# EasyEDA Pro project ReuseBlock_电子工程实训-物联网终端-朱玉施，黄彬_2025-01-02.epro

# Schematic 电子工程实训-物联网终端-朱玉施，黄彬
Board Name: 最小物联网赋能板; Create Date: 2024-11-22; Page Name: P1; Project Name: 24秋专业设计-律动灯条; Schematic Name: Schematic1; Update Date: 2024-12-26; Company: 嘉立创EDA; Page Size: A3; Version: V1.0
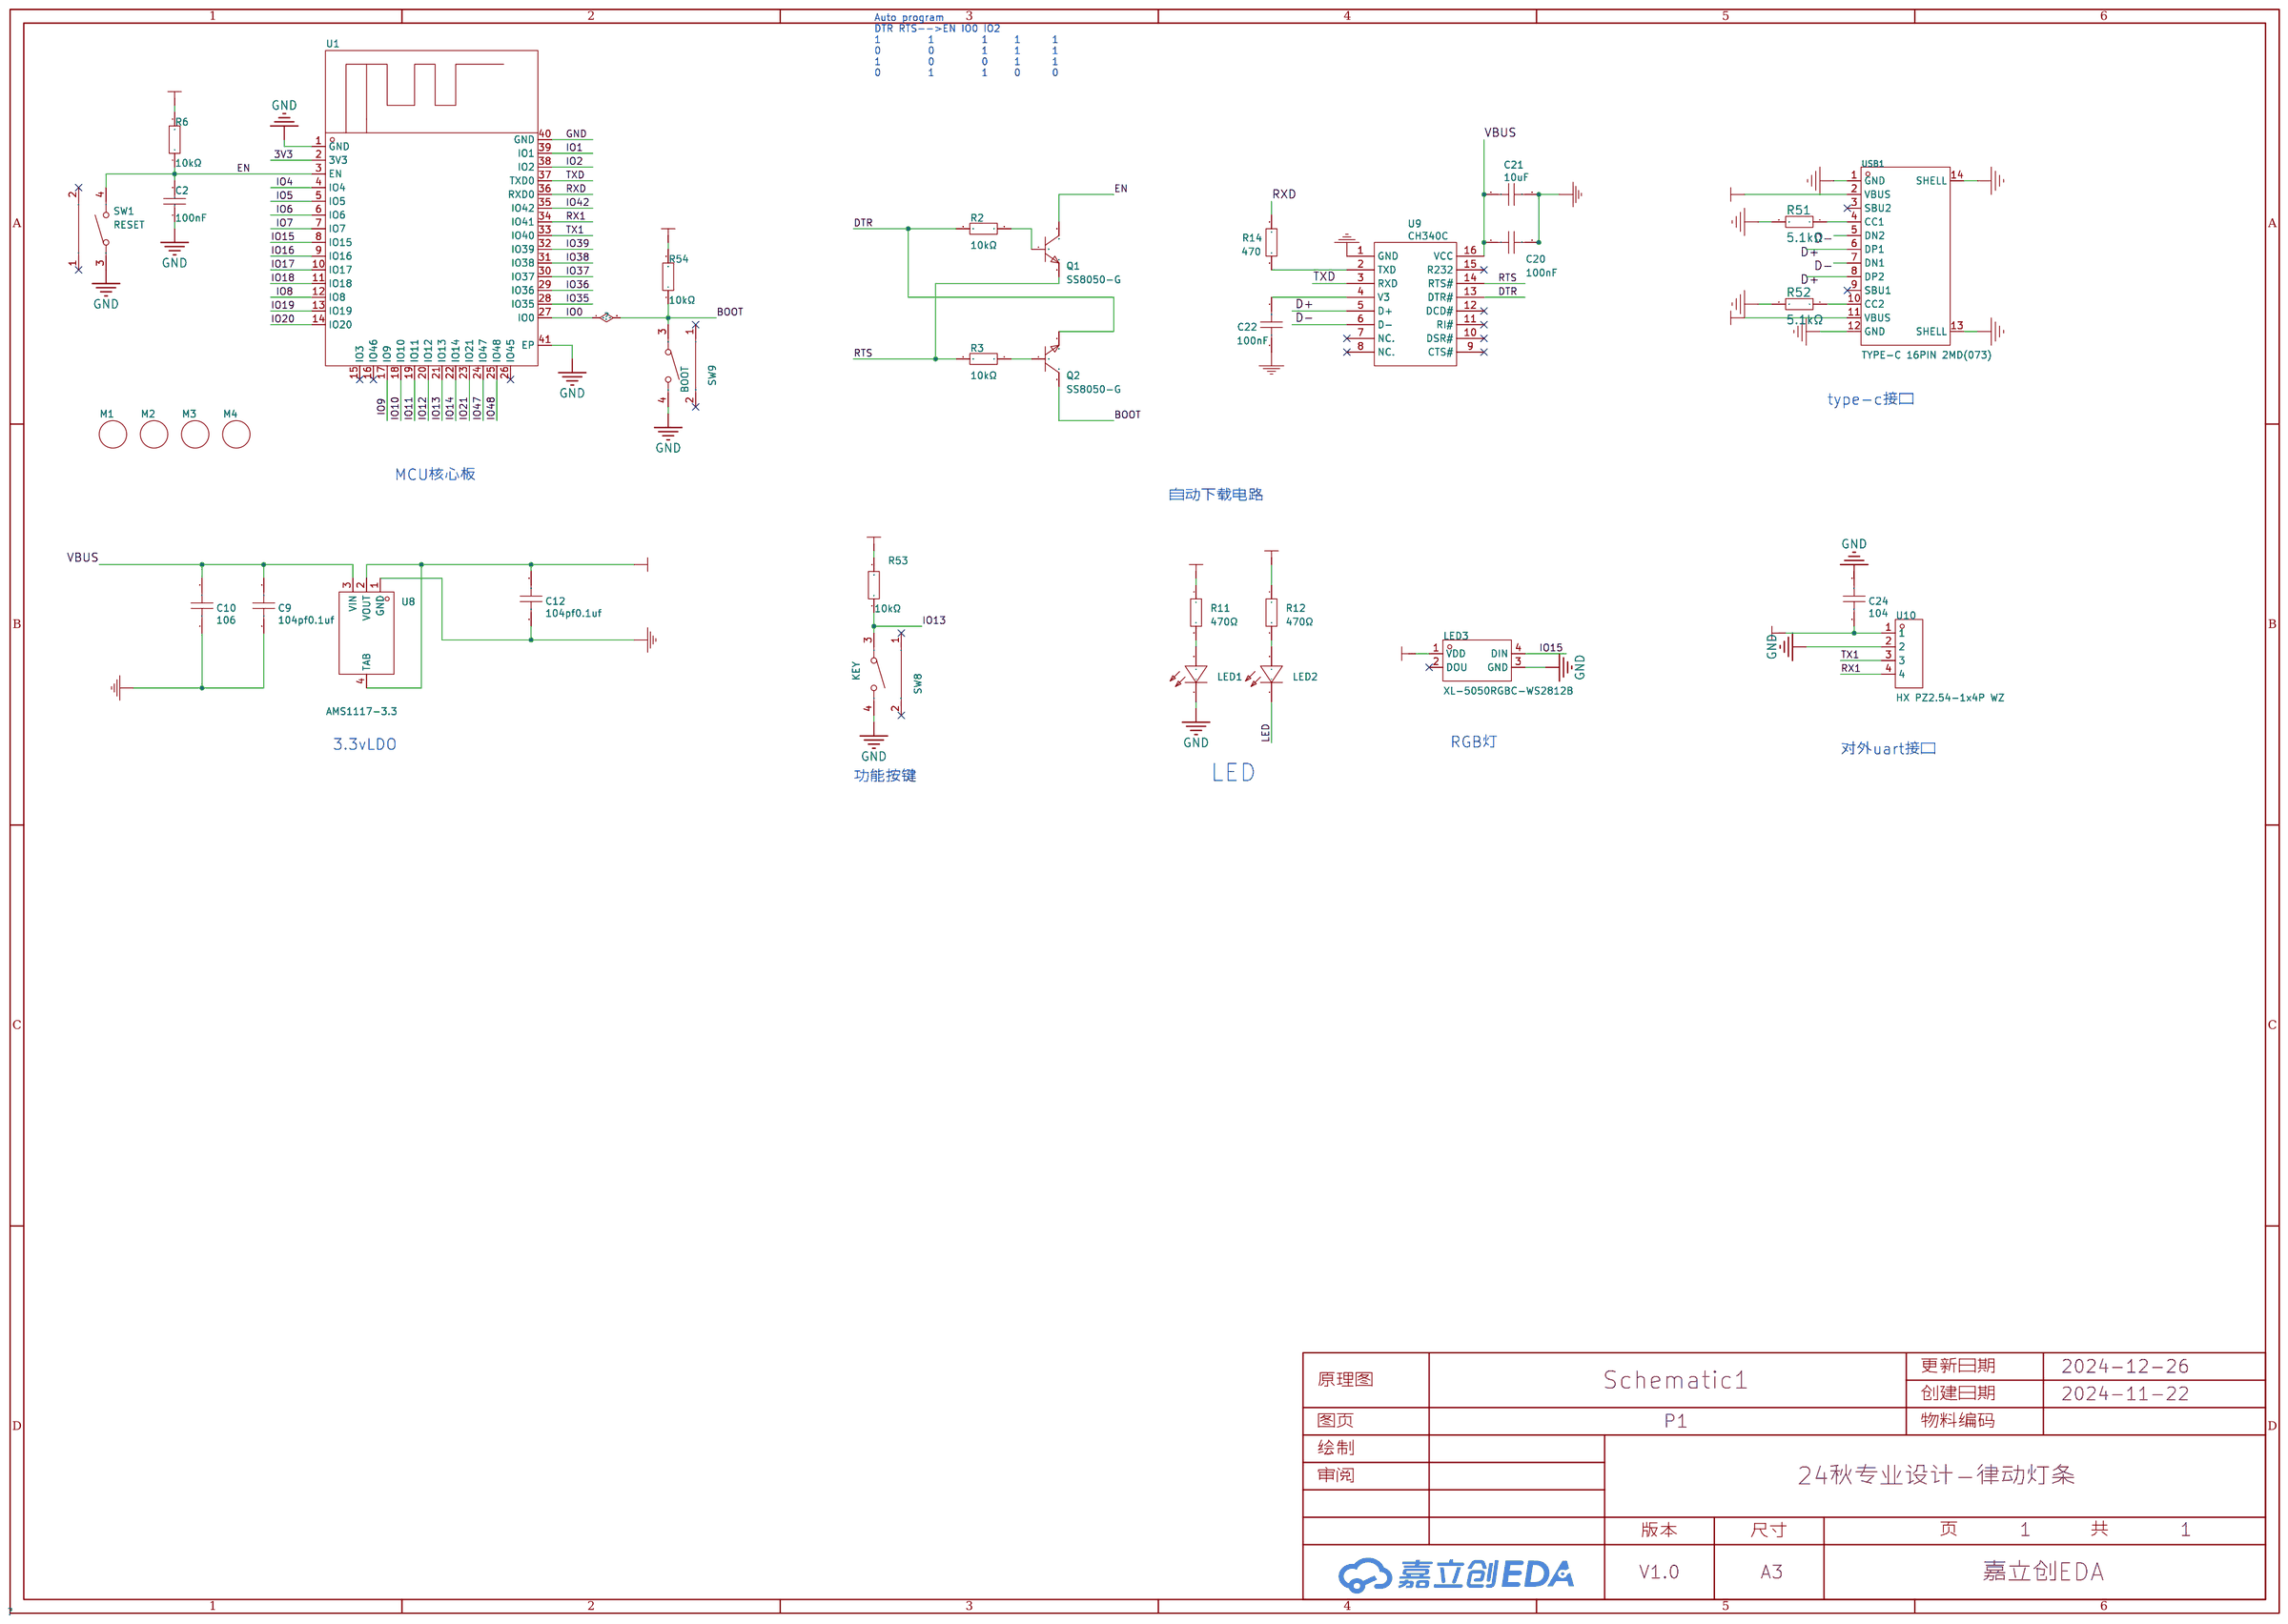
[diagram p0: schematic sheet]

## Parts
C2  100nF  [C0603]
C9  104pf0.1uf  [C0603]
C10  106  [C0603]
C12  104pf0.1uf  [C0603]
C20  100nF  [C0603]
C21  10uF  [C0603]
C22  100nF  [C0603]
C24  104  [C0603]
LED1  TJ-S2012CY8T5ALC2G-A5  [LED0805-RD_GREEN]
LED2  TJ-S2012CY8T5ALC2G-A5  [LED0805-RD_GREEN]
LED3  XL-5050RGBC-WS2812B  [LED-SMD_4P-L5.0-W5.0-BL_XL-5050RGBC]
M1  -  [M3螺丝孔]
M2  -  [M3螺丝孔]
M3  -  [M3螺丝孔]
M4  -  [M3螺丝孔]
Q1  SS8050-G  [SOT-23-3_L2.9-W1.6-P1.90-LS2.8-BR]
Q2  SS8050-G  [SOT-23-3_L2.9-W1.6-P1.90-LS2.8-BR]
R2  10kΩ  [R0603]
R3  10kΩ  [R0603]
R6  10kΩ  [R0603]
R11  470Ω  [R0603]
R12  470Ω  [R0603]
R14  470  [R0603]
R51  5.1kΩ  [R0603]
R52  5.1kΩ  [R0603]
R53  10kΩ  [R0603]
R54  10kΩ  [R0603]
SW1  RESET  [SW-SMD_TS24CA]
SW8  KEY  [SW-SMD_TS24CA]
SW9  BOOT  [SW-SMD_TS24CA]
U1  ESP32-S3-WROOM-1-N8  [WIFIM-SMD_ESP32-S3-WROOM-1-N8]
U8  AMS1117-3.3  [SOT-223-3_L6.5-W3.5-P3.05-LS7.0]
U9  CH340C  [SOP-16_L10.0-W3.9-P1.27-LS6.0-BL]
U10  HX PZ2.54-1x4P WZ  [HDR-TH_4P-P2.54-H-M-W10.3]
USB1  TYPE-C 16PIN 2MD(073)  [USB-C-SMD_TYPE-C-6PIN-2MD-073]

## Library data of the parts
C2 = CL10A105KB8NNNC: 容值:1uF;精度:±10%;额定电压:50V;材质(温度系数):X5R;; LCSC Part Name: 1uF ±10% 50V; Supplier Part: C15849; Manufacturer: SAMSUNG(三星); Supplier Footprint: 0603; JLCPCB Part Class: 基础库; Datasheet: https://atta.szlcsc.com/upload/public/pdf/source/20160103/1457707679084.pdf; Supplier: LCSC; Tolerance: ±10%; Voltage Rated: 50V; Temperature Coefficient: X5R
C9 C10 C12 C24 = 0603B393K101CT: Supplier: LCSC; Supplier Part: C458880; Manufacturer: Walsin Tech Corp
C20 C22 = CC0603KRX7R9BB104: Supplier: LCSC; Manufacturer: YAGEO; Supplier Part: C14663; JLCPCB Part Class: Basic Part
C21 = CL10A106KP8NNNC: Supplier: LCSC; Manufacturer: SAMSUNG; Supplier Part: C19702; JLCPCB Part Class: Basic Part
LED1 LED2 = TJ-S2012CY8T5ALC2G-A5: 发光颜色:翠绿;; LCSC Part Name: 翠绿; Supplier Part: C440522; Manufacturer: TOGIALED(统佳); Supplier Footprint: 0805; JLCPCB Part Class: 扩展库; Datasheet: https://atta.szlcsc.com/upload/public/pdf/source/20191029/C440522_4363B29F18325C993551AE0B09333676.pdf; Supplier: LCSC; Emitted Color: 翠绿
LED3 = XL-5050RGBC-WS2812B: 5050七彩幻彩透明贴片LED灯珠 5050 幻彩透明四脚 ws2812B 内置驱动IC; Supplier Part: C2843785; Manufacturer: XINGLIGHT(成兴光); Supplier Footprint: SMD5050; JLCPCB Part Class: 扩展库; Datasheet: https://atta.szlcsc.com/upload/public/pdf/source/20240412/E1004CAA80592E31D08BFE019083806F.pdf; Supplier: LCSC
M1-M4 = M3螺丝孔
Q1 Q2 = SS8050-G_C164886: VBUS; LCSC Part Name: VBUS; Supplier Part: C164886; Manufacturer: CJ(江苏长电/长晶); Supplier Footprint: SOT-23; JLCPCB Part Class: 扩展库; Datasheet: https://atta.szlcsc.com/upload/public/pdf/source/20171228/C164886_15144412883891213890.pdf; Supplier: LCSC; Transistor Type: NPN; Collector-Emitter Breakdown Voltage (Vceo): VBUS; Collector Current (Ic): 1.5A; Power Dissipation (Pd): 300mW; Collector Cut-Off Current (Icbo): 100nA; Collector-Emitter Saturation Voltage (VCE(sat)@Ic,Ib): 500mV@800mA,80mA; DC Current Gain (hFE@Ic,Vce): 120@100mA,1V; Transition Frequency (fT): 100MHz; Operating Temperature: +150℃@(Tj)
R2 R3 = 0805W8F1002T5E_C17414: 电阻类型:厚膜电阻;阻值:10kΩ;精度:±1%;功率:125mW;; LCSC Part Name: 10kΩ ±1% 125mW; Supplier Part: C17414; Manufacturer: UNI-ROYAL(厚声); Manufacturer Part: 0805W8F1002T5E; Supplier Footprint: 0805; JLCPCB Part Class: 基础库; Datasheet: https://atta.szlcsc.com/upload/public/pdf/source/20200306/C422600_1E6D84923E4A46A82E41ADD87F860B5C.pdf; Supplier: LCSC; Type: 厚膜电阻; Tolerance: ±1%; Power(Watts): 125mW; Temperature Coefficient: ±100ppm/℃; Overload Voltage (Max): 150V; Operating Temperature Range: -55℃~+155℃
R6 R53 R54 = RC0603FR-0710KL: 电阻类型:厚膜电阻;阻值:10kΩ;精度:±1%;功率:100mW;温度系数:±100ppm/℃;最大工作电压:75V;工作温度范围:-55℃~+155℃;; LCSC Part Name: 10kΩ ±1% 100mW; Supplier Part: C98220; Manufacturer: YAGEO(国巨); Supplier Footprint: 0603; JLCPCB Part Class: 扩展库; Datasheet: https://atta.szlcsc.com/upload/public/pdf/source/20170522/1495423494387.pdf; Supplier: LCSC; Type: 厚膜电阻; Tolerance: ±1%; Power(Watts): 100mW; Temperature Coefficient: ±100ppm/℃; Overload Voltage (Max): 75V; Operating Temperature Range: -55℃~+155℃
R11 R12 = 0603WAF5100T5E: 电阻类型:厚膜电阻;阻值:510Ω;精度:±1%;功率:100mW;温度系数:±100ppm/℃;最大工作电压:75V;工作温度范围:-55℃~+155℃;; LCSC Part Name: 510Ω ±1% 100mW; Supplier Part: C23193; Manufacturer: UNI-ROYAL(厚声); Supplier Footprint: 0603; JLCPCB Part Class: 基础库; Datasheet: https://atta.szlcsc.com/upload/public/pdf/source/20200306/C422600_1E6D84923E4A46A82E41ADD87F860B5C.pdf; Supplier: LCSC; Type: 厚膜电阻; Tolerance: ±1%; Power(Watts): 100mW; Temperature Coefficient: ±100ppm/℃; Overload Voltage (Max): 75V; Operating Temperature Range: -55℃~+155℃
R14 = 0603WAF4700T5E: Supplier: LCSC; Manufacturer: UniOhm; Supplier Part: C23179; JLCPCB Part Class: Basic Part
R51 R52 = 0603WAF5101T5E: 电阻类型:厚膜电阻;阻值:5.1kΩ;精度:±1%;功率:100mW;温度系数:±100ppm/℃;; LCSC Part Name: 厚膜电阻 5.1kΩ ±1% 100mW; Supplier Part: C23186; Manufacturer: UNI-ROYAL(厚声); Supplier Footprint: 0603; JLCPCB Part Class: Basic Part; Datasheet: https://atta.szlcsc.com/upload/public/pdf/source/20200306/C422600_1E6D84923E4A46A82E41ADD87F860B5C.pdf; Supplier: LCSC; Type: 厚膜电阻; Tolerance: ±1%; Power(Watts): 100mW; Temperature Coefficient: ±100ppm/℃; Overload Voltage (Max): VBUS; Operating Temperature Range: -55℃~+155℃; Origin Footprint 1: R 0603_M; Design Item ID: R; Library Name: 0.1 - 电阻-电容-电感; BOM名称: 贴片电阻; 联系售后: https://shop463601444.taobao.com; 版权归属: 来自淘宝 ID：黄晶宝石; 封装库来自淘宝卖家 ID：黄晶宝石: 其他店铺购入均为盗版，不享受售后技术支持服务，请立即申请退款; Origin Footprint 2: R 0201_L; Origin Footprint 3: R 0402_L; Origin Footprint 4: R 0603_L; Origin Footprint 5: R 0805_L; Origin Footprint 6: R 1206_L; Origin Footprint 7: R 1210_L; Origin Footprint 8: R 1812_L; Origin Footprint 9: R 2010_L; Origin Footprint 10: R 2512_L; Origin Footprint 11: R 0201_M; Origin Footprint 12: R 0402_M; Origin Footprint 13: R 0805_M; Origin Footprint 14: R 1206_M; Origin Footprint 15: R 1210_M; Origin Footprint 16: R 1812_M; Origin Footprint 17: R 2010_M; Origin Footprint 18: R 2512_M
SW1 SW8 SW9 = TS24CA: 触点电流:50mA;额定电压(DC):12V;电路结构:单刀单掷;安装方式:卧贴;按钮形状:矩形按钮;带灯:-;开关长度:4.55mm;开关宽度:1.8mm;开关高度:3.5mm;; LCSC Part Name: 2*4*3.5半包小贝贝TS-018小侧按键m165蓝牙耳机轻触开关; Supplier Part: C393942; Manufacturer: SHOU HAN(首韩); Supplier Footprint: SMD; JLCPCB Part Class: 扩展库; Datasheet: https://atta.szlcsc.com/upload/public/pdf/source/20190521/C393942_591A9E318887EFA4274D34029981AD99.pdf; Supplier: LCSC; Contact Current: 50mA; Voltage Rating (DC): 12V; Circuit: 单刀单掷; Mounting Style: 卧贴; Actuator Style: 矩形按钮; Switch Length: 4.55mm; Switch Width: 1.8mm; Switch Height: 3.5mm
U1 = ESP32-S3-WROOM-1-N8: Supplier Part: C2913198; Manufacturer: ESPRESSIF(乐鑫); Supplier Footprint: 模块; JLCPCB Part Class: Extended Part; Datasheet: https://atta.szlcsc.com/upload/public/pdf/source/20221026/9A44C6421221D672346AAE72DF9F8146.pdf; Supplier: LCSC
U8 = AMS1117-3.3_C5250992: 输出类型：固定 输出极性：正 最大输入电压：18V 输出电压：3.3V 输出电流：1A 电源纹波抑制比(PSRR)：60dB@(120Hz)。当前应用较多领域：三端稳压器，机顶盒; Supplier Part: C5250992; Manufacturer: TWGMC(台湾迪嘉); Supplier Footprint: SOT-223-3L; JLCPCB Part Class: 扩展库; Datasheet: https://atta.szlcsc.com/upload/public/pdf/source/20221109/A58A92B07670E85D28928AE371260E8D.pdf; Supplier: LCSC
U9 = CH340C: Supplier: LCSC; Manufacturer: WCH; Supplier Part: C84681; JLCPCB Part Class: Extended Part
U10 = HX PZ2.54-1x4P WZ: 插针结构:1x4P;间距:2.54mm;行距:-;圆针/方针:方针;安装类型:弯插;排数:单排;总PIN位数:4P;额定电流:3A;额定电压:-;配合针长度:6mm;塑高:2.5mm;端接针长度:3mm;触头材质:黄铜;触头镀层:金;工作温度范围:-40℃~+105℃;颜色:黑色;; LCSC Part Name: 1x4P 间距:2.54mm 方针 弯插; Supplier Part: C32713263; Manufacturer: hanxia(韩下); Supplier Footprint: 弯插,P=2.54mm; JLCPCB Part Class: 扩展库; Datasheet: https://atta.szlcsc.com/upload/public/pdf/source/20240723/CEFBB84DDE30BB0D161FEC6DC376B233.pdf; Supplier: LCSC; Pin Structure: 1x4P; Pitch: 2.54mm; Circluar Pins/Square Pins: 方针; Mounting Type: 弯插; Number of Rows: 单排; Number of Pins: 4P; Current Rating (Max): 3A; Length of Mating Pin: 6mm; Insulation Height: 2.5mm; Length of End Connection Pin: 3mm; Contact Material: 黄铜; Contact Plating: 金; Operating Temperature Range: -40℃~+105℃; Color: 黑色
USB1 = TYPE-C 16PIN 2MD(073): 连接器类型:Type-C;标准:-;公母:母座;触点数量:16;端口数量:1;安装方式:卧贴;额定电流 - 电源:5A;工作温度范围:-25℃~+85℃;; LCSC Part Name: TYPE-C母座 16P 4脚插件带定位柱 不锈钢外壳 2次模顶; Supplier Part: C2765186; Manufacturer: SHOU HAN(首韩); Supplier Footprint: SMD; JLCPCB Part Class: Extended Part; Supplier: LCSC; Connector Type: Type-C; Gender: 母座; Number of Contacts: 16; Number of Ports: 1; Mounting Style: 卧贴; Current Rating - Power (Max): 5A; Operating Temperature Range: -25℃~+85℃

## Nets
3V3: C12.2 C24.1 LED3.1(VDD) R6.2 R11.1 R12.1 R53.2 R54.2 U1.2(3V3) U8.2(VOUT) U8.4(TAB) U10.1
GND: C2.1 C9.1 C10.1 C12.1 C20.2 C21.2 C22.1 C24.2 LED1.1(-) LED3.3(GND) R51.2 R52.2 SW1.3 SW8.4 SW9.4 U1.1(GND) U1.40(GND) U1.41(EP) U8.1(GND) U9.1(GND) U10.2 USB1.1(GND) USB1.12(GND) USB1.13(SHELL) USB1.14(SHELL)
VBUS: C9.2 C10.2 C20.1 C21.1 U8.3(VIN) U9.16(VCC) USB1.2(VBUS) USB1.11(VBUS)
BOOT: Q2.3(C) R54.1 SW9.3 U1.27(IO0)
D+: U9.5(D+) USB1.6(DP1) USB1.8(DP2)
D-: U9.6(D-) USB1.5(DN2) USB1.7(DN1)
DTR: Q2.2(E) R2.2 U9.13(DTR#)
EN: C2.2 Q1.3(C) R6.1 SW1.4 U1.3(EN)
IO1: U1.39(IO1)
IO2: U1.38(IO2)
IO4: U1.4(IO4)
IO5: U1.5(IO5)
IO6: U1.6(IO6)
IO7: U1.7(IO7)
IO8: U1.12(IO8)
IO9: U1.17(IO9)
IO10: U1.18(IO10)
IO11: U1.19(IO11)
IO12: U1.20(IO12)
IO13: R53.1 SW8.3 U1.21(IO13)
IO14: U1.22(IO14)
IO15: LED3.4(DIN) U1.8(IO15)
IO16: U1.9(IO16)
IO17: U1.10(IO17)
IO18: U1.11(IO18)
IO19: U1.13(IO19)
IO20: U1.14(IO20)
IO21: U1.23(IO21)
IO35: U1.28(IO35)
IO36: U1.29(IO36)
IO37: U1.30(IO37)
IO38: U1.31(IO38)
IO39: U1.32(IO39)
IO42: U1.35(IO42)
IO47: U1.24(IO47)
IO48: U1.25(IO48)
LED: LED2.1(-)
RTS: Q1.2(E) R3.2 U9.14(RTS#)
RX1: U1.34(IO41) U10.4
RXD: R14.1 U1.36(RXD0)
TX1: U1.33(IO40) U10.3
TXD: U1.37(TXD0) U9.3(RXD)
$1N1434: Q1.1(B) R2.1
$1N1435: Q2.1(B) R3.1
$1N1444: R14.2 U9.2(TXD)
$1N1449: C22.2 U9.4(V3)
$1N2488: R51.1 USB1.4(CC1)
$1N2489: R52.1 USB1.10(CC2)
Net-(LED1-2): LED1.2(+) R11.2
Net-(LED2-2): LED2.2(+) R12.2

Not connected (* = marked no-connect by the designer): LED3 2(DOU)*; SW1 1* 2*; SW8 1* 2*; SW9 1* 2*; U1 15(IO3)* 16(IO46)* 26(IO45)*; U9 7(NC.)* 8(NC.)* 9(CTS#)* 10(DSR#)* 11(RI#)* 12(DCD#)* 15(R232)*; USB1 3(SBU2)* 9(SBU1)*

## Notes on the sheet
- Auto program
  DTR RTS-->EN IO0 IO2
  1         1         1     1      1
  0         0         1     1      1
  1         0         0     1      1
  0         1         1     0      0
- type-c接口
- MCU核心板
- 自动下载电路
- 3.3vLDO
- RGB灯
- 对外uart接口
- 功能按键
- LED

# Board 电子工程实训-物联网终端-朱玉施，黄彬
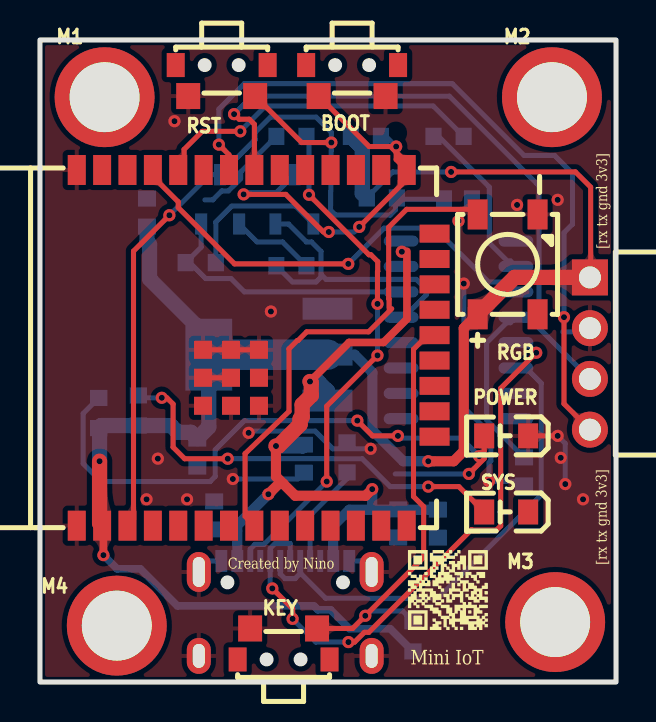
[diagram p1: board, top side]
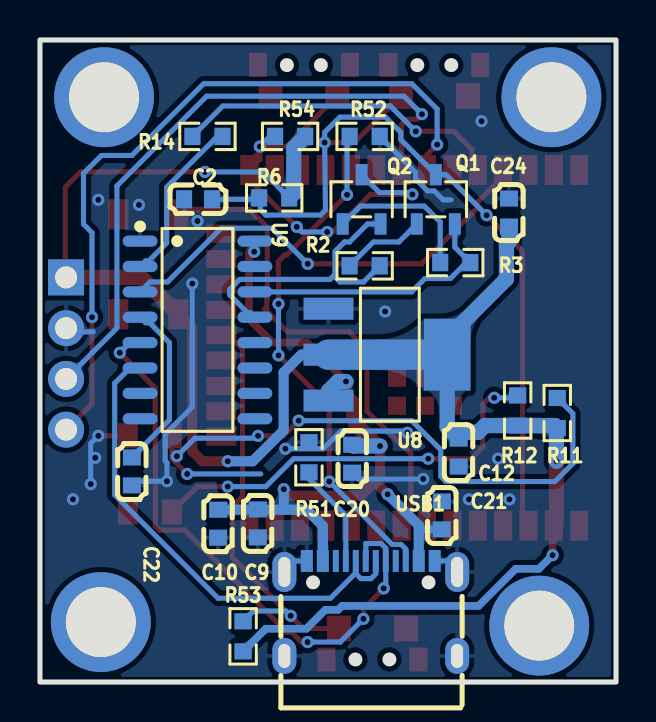
[diagram p2: board, bottom side, seen from below]

Outline 28.83 x 32.13 mm; copper layers: Top Layer, Bottom Layer. Coordinates in mm from the lower left corner of the outline.
Outline path: rectangle 0,32.13 28.83,0
Stack: Top Layer 0.035mm / Dielectric1 1.51mm FR4 er 4.5 / Bottom Layer 0.035mm

## Design rules (mm)
template: JLCPCB Capability(Two Layers Board)
spacing copperThickness1oz (default): track to track 0.102, other pairs 0.152 to 0.3
spacing copperThickness2oz: track to track 0.203, other pairs 0.152 to 0.3
track width copperThickness1oz (default): min 0.127, default 0.254, max 2.54
track width copperThickness2oz: min 0.203, default 0.254, max 2.54
differential pair differentialPair (default): width min 0.127, default 0.254, max 2.54; gap min 0.152, default 0.152
via viaSize (default): diameter min 0.5, default 0.61, max 10; hole min 0.3, default 0.305, max 6.3

## Placement (name value [footprint] x y rotation side)
BOOT  BOOT  [SW-SMD_TS24CA]  15.62 30.1 0 top
C2  100nF  [C0603]  20.92 24.16 180 bottom
C9  104pf0.1uf  [C0603]  17.93 7.94 90 bottom
C10  106  [C0603]  19.91 7.92 90 bottom
C12  104pf0.1uf  [C0603]  7.87 11.48 90 bottom
C20  100nF  [C0603]  13.21 11.18 270 bottom
C21  10uF  [C0603]  8.72 8.34 90 bottom
C22  100nF  [C0603]  24.23 10.54 90 bottom
C24  104  [C0603]  5.35 23.5 90 bottom
KEY  KEY  [SW-SMD_TS24CA]  12.19 1.91 180 top
M1  -  [M3螺丝孔]  3.23 29.27 0 top
M2  -  [M3螺丝孔]  25.62 29.27 0 top
M3  -  [M3螺丝孔]  25.78 3 0 top
M4  -  [M3螺丝孔]  3.84 2.82 0 top
POWER  TJ-S2012CY8T5ALC2G-A5  [LED0805-RD_GREEN]  23.33 12.32 180 top
Q1  SS8050-G  [SOT-23-3_L2.9-W1.6-P1.90-LS2.8-BR]  9.02 24.16 270 bottom
Q2  SS8050-G  [SOT-23-3_L2.9-W1.6-P1.90-LS2.8-BR]  12.73 24.16 270 bottom
R2  10kΩ  [R0603]  12.58 20.83 180 bottom
R3  10kΩ  [R0603]  8.05 20.99 180 bottom
R6  10kΩ  [R0603]  17.11 24.23 180 bottom
R11  470Ω  [R0603]  2.94 13.46 90 bottom
R12  470Ω  [R0603]  4.92 13.59 90 bottom
R14  470  [R0603]  20.45 27.31 180 bottom
R51  5.1kΩ  [R0603]  15.37 11.25 90 bottom
R52  5.1kΩ  [R0603]  12.58 27.31 180 bottom
R53  10kΩ  [R0603]  18.66 2.29 270 bottom
R54  10kΩ  [R0603]  16.31 27.31 180 bottom
RGB  XL-5050RGBC-WS2812B  [LED-SMD_4P-L5.0-W5.0-BL_XL-5050RGBC]  23.4 20.9 0 top
RST  RESET  [SW-SMD_TS24CA]  9.09 30.1 0 top
SYS  TJ-S2012CY8T5ALC2G-A5  [LED0805-RD_GREEN]  23.33 8.51 180 top
U1  ESP32-S3-WROOM-1-N8  [WIFIM-SMD_ESP32-S3-WROOM-1-N8]  10.79 16.72 90 top
U8  AMS1117-3.3  [SOT-223-3_L6.5-W3.5-P3.05-LS7.0]  11.42 16.38 0 bottom
U9  CH340C  [SOP-16_L10.0-W3.9-P1.27-LS6.0-BL]  20.95 17.62 270 bottom
U10  HX PZ2.54-1x4P WZ  [HDR-TH_4P-P2.54-H-M-W10.3]  27.52 16.44 270 top
USB1  TYPE-C 16PIN 2MD(073)  [USB-C-SMD_TYPE-C-6PIN-2MD-073]  12.27 3.68 180 bottom

## Footprints (pads in the part's own frame, mm; a bottom-side part is the same pattern mirrored in y, then rotated)
C0603
  rect 0.8x0.9 smd: 1(-0.7,0) 2(0.7,0)
HDR-TH_4P-P2.54-H-M-W10.3
  rect 1.8x1.8 hole 1.1: 1(-3.81,0)
  round 1.8 hole 1.1: 2(-1.27,0) 3(1.27,0) 4(3.81,0)
LED0805-RD_GREEN
  rect 1.001x1.25 smd: 1(-1.1,0) 2(1.1,0)
LED-SMD_4P-L5.0-W5.0-BL_XL-5050RGBC
  rect 1x1.5 smd: 1(-1.5,-2.5) 2(1.5,-2.5) 3(1.5,2.5) 4(-1.5,2.5)
M3螺丝孔
  round 5 hole 3.5: 1(0,0)
R0603
  rect 0.806x0.864 smd: 1(-0.753,0) 2(0.753,0)
SOP-16_L10.0-W3.9-P1.27-LS6.0-BL
  oval 0.56x1.745 smd: 1(-4.445,-2.873) 2(-3.175,-2.873) 3(-1.905,-2.873) 4(-0.635,-2.873) 5(0.635,-2.873) 6(1.905,-2.873) 7(3.175,-2.873) 8(4.445,-2.873) 9(4.445,2.873) 10(3.175,2.873) 11(1.905,2.873) 12(0.635,2.873) 13(-0.635,2.873) 14(-1.905,2.873) 15(-3.175,2.873) 16(-4.445,2.873)
SOT-23-3_L2.9-W1.6-P1.90-LS2.8-BR
  rect 1.07x0.6 smd: 1(1.235,-0.95) 2(1.235,0.95) 3(-1.235,0)
SOT-223-3_L6.5-W3.5-P3.05-LS7.0
  rect 2.5x1.1 smd: 1(2.97,-2.3) 2(2.97,0) 3(2.97,2.3)
  rect 2.34x3.6 smd: 4(-2.97,0)
SW-SMD_TS24CA
  rect 0.9x1.2 smd: 1(-2.3,0.775) 2(2.3,0.775)
  rect 1.2x1.3 smd: 3(-1.675,-0.775) 4(1.675,-0.775)
USB-C-SMD_TYPE-C-6PIN-2MD-073
  rect 0.6x1.1 smd: 1(-3.2,2.375) 2(-2.4,2.375) 11(2.4,2.375) 12(3.2,2.375)
  rect 0.3x1.1 smd: 3(-1.75,2.375) 4(-1.25,2.375) 5(-0.75,2.375) 6(-0.25,2.375) 7(0.25,2.375) 8(0.75,2.375) 9(1.25,2.375) 10(1.75,2.375)
  oval 1.2x1.8 hole 0.6x1.2: 13(-4.325,-2.375) 14(4.325,-2.375)
  oval 1.2x2 hole 0.6x1.5: 13(-4.325,1.825) 14(4.325,1.825)
WIFIM-SMD_ESP32-S3-WROOM-1-N8
  rect 1.5x0.9 smd: 1(-8.9,8.954) 2(-8.9,7.684) 3(-8.9,6.415) 4(-8.9,5.144) 5(-8.9,3.874) 6(-8.9,2.604) 7(-8.9,1.335) 8(-8.9,0.065) 9(-8.9,-1.206) 10(-8.9,-2.475) 11(-8.9,-3.745) 12(-8.9,-5.016) 13(-8.9,-6.285) 14(-8.9,-7.556) 27(8.9,-7.556) 28(8.9,-6.285) 29(8.9,-5.016) 30(8.9,-3.745) 31(8.9,-2.475) 32(8.9,-1.206) 33(8.9,0.065) 34(8.9,1.335) 35(8.9,2.604) 36(8.9,3.874) 37(8.9,5.144) 38(8.9,6.415) 39(8.9,7.684) 40(8.9,8.954)
  rect 0.9x1.5 smd: 17(-4.445,-8.954) 18(-3.175,-8.954) 19(-1.905,-8.954) 20(-0.635,-8.954) 21(0.635,-8.954) 22(1.905,-8.954) 23(3.175,-8.954) 24(4.445,-8.954) 25(5.715,-8.954)
  rect 0.9x0.9 smd: 41(-2.9,2.635) 41(-2.9,1.235) 41(-2.9,-0.165) 41(-1.5,2.635) 41(-1.5,1.235) 41(-1.5,-0.165) 41(-0.1,2.635) 41(-0.1,1.235) 41(-0.1,-0.165)

## Nets
As in the schematic, except:
3V3: C12.2 C24.1 R6.2 R11.1 R12.1 R53.2 R54.2 RGB.1 U1.2 U8.2 U8.4 U10.1
GND: BOOT.4 C2.1 C9.1 C10.1 C12.1 C20.2 C21.2 C22.1 C24.2 KEY.4 POWER.1 R51.2 R52.2 RGB.3 RST.3 U1.1 U1.40 U1.41 U8.1 U9.1 U10.2 USB1.1 USB1.12 USB1.13 USB1.14
BOOT: BOOT.3 Q2.3 R54.1 U1.27
EN: C2.2 Q1.3 R6.1 RST.4 U1.3
IO13: KEY.3 R53.1 U1.21
IO15: RGB.4 U1.8
$1N2023: POWER.2 R11.2
$1N2024: R12.2 SYS.2

Pads without a net: BOOT 1 2; KEY 1 2; M1 1; M2 1; M3 1; M4 1; RGB 2; RST 1 2; U9 7 8 9 10 11 12 15; USB1 3 9

## Via types
v1: diameter 0.61, hole 0.305, Top Layer to Bottom Layer, 53 vias

## Routing (per net, layer and track width the routed paths; a pad name or vN(x,y) marks a point on that pad's centre or on a via; arc(x,y) is an arc through that point)
3V3: length 91.6
  Top Layer w0.254: U10.1 27.56,20.29 27.56,24.77 26.8,25.53 v1(20.57,25.53)
  Top Layer w0.381: v1(3.18,6.35) 3.18,7.76
  Top Layer w0.508: v1(19.43,11.05) 20.7,11.05 21.21,11.56 21.21,17.71 RGB.1
  Top Layer w0.762: v1(2.98,11.05) 2.98,7.95 U1.2 ; U10.1 23.75,20.25 RGB.1
  Bottom Layer w0.254: R6.2 17.65,25.53 v1(20.57,25.53)
  Bottom Layer w0.381: v1(3.18,6.35) 3.86,5.67 5.02,5.67 6.88,3.81 13.72,3.81 13.91,3.61 14.55,3.61 15.49,2.67 17.53,2.67 R53.2
  Bottom Layer w0.508: v1(19.43,11.05) 18.18,11.05 16.64,12.59 16.64,15.49 15.75,16.38 U8.2
  Bottom Layer w0.762: R6.2 16.13,24.45 16.13,26.73 R54.2 ; v1(2.98,11.05) 2.98,12.76 3.06,12.84 R12.1 6.56,12.84 6.9,12.5 7.56,12.5 C12.2 8.45,12.76 U8.4 7.81,17.02 7.81,17.84 5.49,20.17 5.49,21.9 5.35,22.03 C24.1
  Bottom Layer w1.524: U8.2 U8.4
GND: length 40
  Top Layer w0.254: U1.41 U1.41 ; U1.41 U1.41 U1.41 ; v1(25.91,12.32) POWER.1
  Bottom Layer w0.254: 8.25,24.13 8.65,24.13 9.1,24.58 9.43,24.58 10.04,25.19 10.04,25.52 R52.2 ; v1(26.29,9.91) 26.29,11.94 v1(25.91,12.32) ; USB1.14 8.5,6.06 USB1.12 ; U10.2 27.34,17.53 26.16,17.53 ; v1(10.44,12.47) 10.53,12.56 13.77,12.56 14.65,11.67 v1(16.55,11.67) ; C22.1 24.02,10.05 v1(22.47,10.05) 22.47,10.97 22.56,11.06 22.56,12.4 21.21,13.76 v1(21.21,19.94) ; USB1.13 16.05,6.06 USB1.1 ; C20.2 12.89,10.16 v1(9.65,10.16)
  vias: v1(5.33,9.14) v1(5.9,11.18) v1(6.73,28.07) v1(7.36,9.14) v1(11.56,18.54) v1(20.95,23.07) v1(23.88,23.88) v1(25.91,24.13) v1(26.06,11.22) v1(27.18,9.14)
VBUS: length 38.5
  Top Layer w0.381: 18.36,21.55 18.36,18.17 17.19,16.99 15.47,16.99 v1(13.51,15.04)
  Top Layer w0.508: 12.16,9.93 12.78,9.32 16.3,9.32 v1(16.63,9.65) ; 12.16,9.93 11.81,10.29 v1(11.81,11.81) ; 12.16,9.93 11.97,9.93 v1(11.43,9.4)
  Top Layer w0.762: v1(13.51,15.04) 13.58,14.97 13.58,14.34 13.12,13.88 13.12,13.27 13.02,13.16 13.02,12.89 11.94,11.81 v1(11.81,11.81)
  Bottom Layer w0.381: C21.1 9.81,7.64 9.87,7.58 ; U9.16 18.11,22.03 v1(18.11,21.53)
  Bottom Layer w0.508: 14.67,6.06 14.67,7.81 15.48,8.62 16.63,8.62 ; v1(11.43,9.4) 9.87,7.84 9.87,6.06 ; 16.63,8.62 C10.2 ; 16.63,8.62 v1(16.63,9.65)
  Bottom Layer w0.762: v1(11.81,11.81) 13.14,11.81 C20.1 ; U8.3 14.39,14.57 13.92,15.04 v1(13.51,15.04)
BOOT: length 22.3
  Top Layer w0.254: BOOT.3 16.47,26.8 17.54,26.8 ; 17.83,26.52 17.54,26.8 ; 17.83,26.52 18.26,26.08 18.26,25.71 ; 17.83,26.52 v1(17.83,26.8) 17.54,26.8 ; 17.83,26.52 17.83,26.15 18.26,25.71 ; v1(15.98,22.78) 18.26,25.06 18.26,25.63 ; 18.26,25.71 U1.27 18.26,25.63 ; 18.26,25.71 18.26,25.63 ; v1(10.19,24.4) 12.3,24.4 14.18,22.52 v1(14.45,22.52)
  Bottom Layer w0.254: v1(10.19,24.4) 10.28,24.49 11.83,24.49 Q2.3 ; v1(14.45,22.52) 15.72,22.52 v1(15.98,22.78) ; v1(17.83,26.8) 17.32,27.31 R54.1
D+: length 29.9
  Top Layer w0.254: v1(11.63,4.69) 12.64,3.67 v1(12.64,3.16) ; v1(15.44,2) 15.75,2 16.23,2.49 16.46,2.49 21.59,7.62 21.6,7.62 21.62,7.61 22.85,7.61 23.06,7.81 23.06,14.7 v1(24.83,16.48)
  Bottom Layer w0.254: v1(11.63,4.69) 11.52,4.79 USB1.8 11.52,6.69 11.76,6.93 12.52,6.93 USB1.6 ; U9.5 24.33,16.99 v1(24.83,16.48) ; v1(15.44,2) 13.8,2 v1(12.64,3.16)
D-: length 24.4
  Bottom Layer w0.254: 13.02,5.43 USB1.5 ; 13.02,5.43 12.77,5.17 12.26,5.17 12.02,5.41 USB1.7 ; 13.02,5.43 13.06,5.43 14.3,4.19 19.91,4.19 25.09,9.37 25.09,14.95 24.33,15.72 23.82,15.72
DTR: length 14.4
  Bottom Layer w0.254: Q2.2 12.44,22.92 13.34,22.02 13.59,22.02 14.07,21.54 14.07,20.4 ; U9.13 18.31,18.49 18.45,18.49 19.34,19.39 19.34,19.64 18.84,20.15 14.32,20.15 14.07,20.4 ; R2.2 12.63,20.02 13.81,20.02 14.07,20.27 14.07,20.4
EN: length 42.2
  Top Layer w0.254: v1(6.48,23.36) 4.68,21.56 4.68,8.13 U1.3 ; RST.4 13.09,27 v1(14.58,27)
  Bottom Layer w0.254: 17.79,24.16 17.79,23.64 17.53,23.37 14.79,23.37 14.54,23.62 v1(14.58,27) 14.58,27.51 13.82,28.27 11.53,28.27 10.77,27.51 10.77,27.15 Q1.3 8.51,25.39 v1(6.48,23.36) ; 17.79,24.16 17.86,24.23 ; 17.79,24.16 C2.2
IO13: length 21.5
  Top Layer w0.254: U1.21 19.4,17.36 18.69,16.65 18.69,9.28 19.2,8.78 19.2,6.24 v1(16.28,3.31) 15.65,2.68 KEY.3
  Bottom Layer w0.254: R53.1 18.15,3.56 16.52,3.56 v1(16.28,3.31)
IO15: length 25
  Top Layer w0.254: 17.6,18.68 16.45,17.53 13.35,17.53 12.92,17.09 12.88,17.09 12.46,16.67 12.46,13.54 10.27,11.43 10.27,8.29 U1.8 ; 17.47,18.68 17.47,19.17 17.45,19.19 17.45,22.76 18.35,23.66 21.65,23.66 RGB.4
RTS: length 13.6
  Bottom Layer w0.254: 7.39,21.09 R3.2 ; 7.39,21.09 8.29,20.19 9.56,20.19 10.23,19.53 U9.14 ; 7.39,21.09 8.07,21.76 Q1.2
RX1: length 36.9
  Top Layer w0.254: v1(8.95,26.89) 9.46,26.39 U1.34 ; U10.4 26.22,13.93 v1(26.22,18.26)
  Bottom Layer w0.254: v1(26.22,18.26) 26.22,22.49 26.65,22.91 26.65,25.45 25.75,26.35 24.23,26.35 20.64,29.94 10.22,29.94 8.95,28.67 v1(8.95,26.89)
RXD: length 16.7
  Top Layer w0.254: U1.36 7.21,25.92 7.21,26.65 8.12,27.56 v1(10.02,27.56)
  Bottom Layer w0.254: v1(10.02,27.56) 11.29,28.83 19.68,28.83 R14.1
TX1: length 31.7
  Top Layer w0.254: U1.33 10.73,27.91 10.48,28.16 9.97,28.16 v1(9.71,28.42)
  Bottom Layer w0.254: U10.3 24.98,17.71 24.98,24.83 20.49,29.32 10.61,29.32 v1(9.71,28.42)
TXD: length 22.5
  Top Layer w0.254: U1.37 5.65,25.3 6.92,24.03 6.92,23.74 9.74,20.93 v1(15.43,20.93)
  Bottom Layer w0.254: U9.3 23.33,20.02 22.45,20.02 19.76,22.71 17.22,22.71 v1(15.43,20.93)
$1N1434: length 4.2
  Bottom Layer w0.254: 9.97,22.92 10.87,22.02 12.14,22.02 R2.1
$1N1435: length 7.6
  Bottom Layer w0.254: Q2.1 12.78,23.82 9.6,23.82 8.8,23.02 R3.1
$1N1444: length 8.5
  Bottom Layer w0.254: R14.2 19.95,27.31 22.49,24.77 22.49,21.97 23.39,21.07 23.54,21.07 23.82,20.8
$1N1449: length 8.5
  Bottom Layer w0.254: C22.2 22.35,13.12 22.35,16.98 23.35,17.98 23.54,17.98 U9.4
$1N2023: length 32.8
  Top Layer w0.254: v1(21.46,10.41) 22.23,11.18 22.23,11.56 ; 22.23,11.56 v1(21.98,11.3) ; 22.23,11.56 POWER.2 ; v1(15.88,13.08) 16.64,12.32 v1(17.91,12.32)
  Bottom Layer w0.254: v1(15.88,13.08) 10.23,13.08 8.77,11.62 8.77,10.29 8.52,10.03 3.06,10.03 2.16,10.93 2.16,13.44 R11.2 ; v1(21.98,11.3) 21.08,12.2 18.03,12.2 v1(17.91,12.32) ; 17.78,10.41 v1(21.46,10.41)
$1N2024: length 21
  Top Layer w0.254: v1(9.4,11.18) 7.24,11.18 6.66,11.75 6.66,13.91 6.35,14.22 v1(6.1,14.22) ; v1(19.43,9.78) 20.96,9.78 SYS.2
  Bottom Layer w0.254: v1(9.4,11.18) 16.13,11.18 17.53,9.78 v1(19.43,9.78) ; R12.2 5.04,14.22 v1(6.1,14.22)
$1N2488: length 5.2
  Bottom Layer w0.254: 15.62,10.43 13.52,8.33 USB1.4
$1N2489: length 25.7
  Top Layer w0.254: v1(13.46,24.38) 16.46,21.38 16.56,21.38 16.9,21.04 16.9,20.56 16.89,20.55 v1(16.89,18.92) ; v1(14.35,10.03) 14.35,13.81 v1(16.89,16.35)
  Bottom Layer w0.254: v1(13.46,24.38) 13.46,27.18 R52.1 ; USB1.10 10.52,6.65 10.76,6.89 11.21,6.89 v1(14.35,10.03) ; v1(16.89,16.35) v1(16.89,18.92)

## Copper pours and planes (outline as drawn; the poured copper is in the pictures)
GND on Top Layer: -1.4,33.91 30.23,33.91 30.23,-1.78 -1.4,-1.78
GND on Bottom Layer: -1.4,33.4 29.46,33.4 29.46,-1.02 -1.4,-1.02

Small or netless copper shapes (teardrops, artwork), in the pictures only: 63 on Top Layer, 101 on Bottom Layer

## Text on the board
Top Silkscreen Layer: Created by Nino | [rx tx gnd 3v3] | Mini IoT
